# Altium schematic sheet BALANCING IC.SchDoc
size A
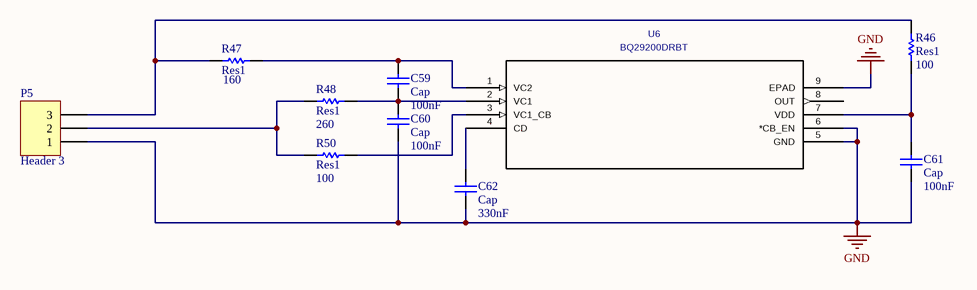
[diagram p0: BALANCING IC.SchDoc]

## Parts
C59  Cap  value 100nF  [0402-A]
C60  Cap  value 100nF  [0402-A]
C61  Cap  value 100nF  [0402-A]
C62  Cap  value 330nF  [6-0805_M]
P5  Header 3  [conn3_2-1445050-3_TEC]
R46  Res1  value 100  [0402-A]
R47  Res1  value 160  [0402-A]
R48  Res1  value 260  [0402-A]
R50  Res1  value 100  [0402-A]
U6  BQ29200DRBT  [DRB8_1P6X2P4]

## Nets
GND: C60.1 C61.2 C62.1 P5.1 U6.5(GND) U6.6(*CB_EN) U6.9(EPAD)
NetC59_1: C59.1 R47.2 U6.1(VC2)
NetC59_2: C59.2 C60.2 R48.2 U6.2(VC1)
NetC61_1: C61.1 R46.2 U6.7(VDD)
NetC62_2: C62.2 U6.4(CD)
NetP5_2: P5.2 R48.1 R50.1
NetP5_3: P5.3 R46.1 R47.1
NetR50_2: R50.2 U6.3(VC1_CB)

Not connected (* = marked no-connect by the designer): U6 8(OUT)

## Library data of the parts
C59-C62 = Cap: Capacitor; Published: 8-Jun-2000; LatestRevisionDate: 17-Jul-2002; LatestRevisionNote: Re-released for DXP Platform.; PackageReference: RAD-0.3; Publisher: Altium Limited; PackageDescription: Radial Cap, Thru-Hole; 2 Leads; 0.3 in Pin Spacing
P5 = Header 3: Header, 3-Pin; LatestRevisionDate: 17-Jul-2002; LatestRevisionNote: Re-released for DXP Platform.; Publisher: Altium Limited
R46-R48 R50 = Res1: Resistor; Published: 8-Jun-2000; LatestRevisionDate: 17-Jul-2002; LatestRevisionNote: Re-released for DXP Platform.; PackageReference: AXIAL-0.3; Publisher: Altium Limited; PackageDescription: Axial Device, Thru-Hole; 2 Leads; 0.3 in Pin Spacing
U6 = BQ29200DRBT: Manufacturer: Texas Instruments; C: Copyright (C) 2015 Accelerated Designs. All rights reserved; Built_By: EMA_UL_Team; Value: BQ29200DRBT; Vendor: Vendor; Manufacturer_Part_Number: BQ29200DRBT